# EAGLE design Motorsteuerung_v3 (EAGLE 9.6.2)
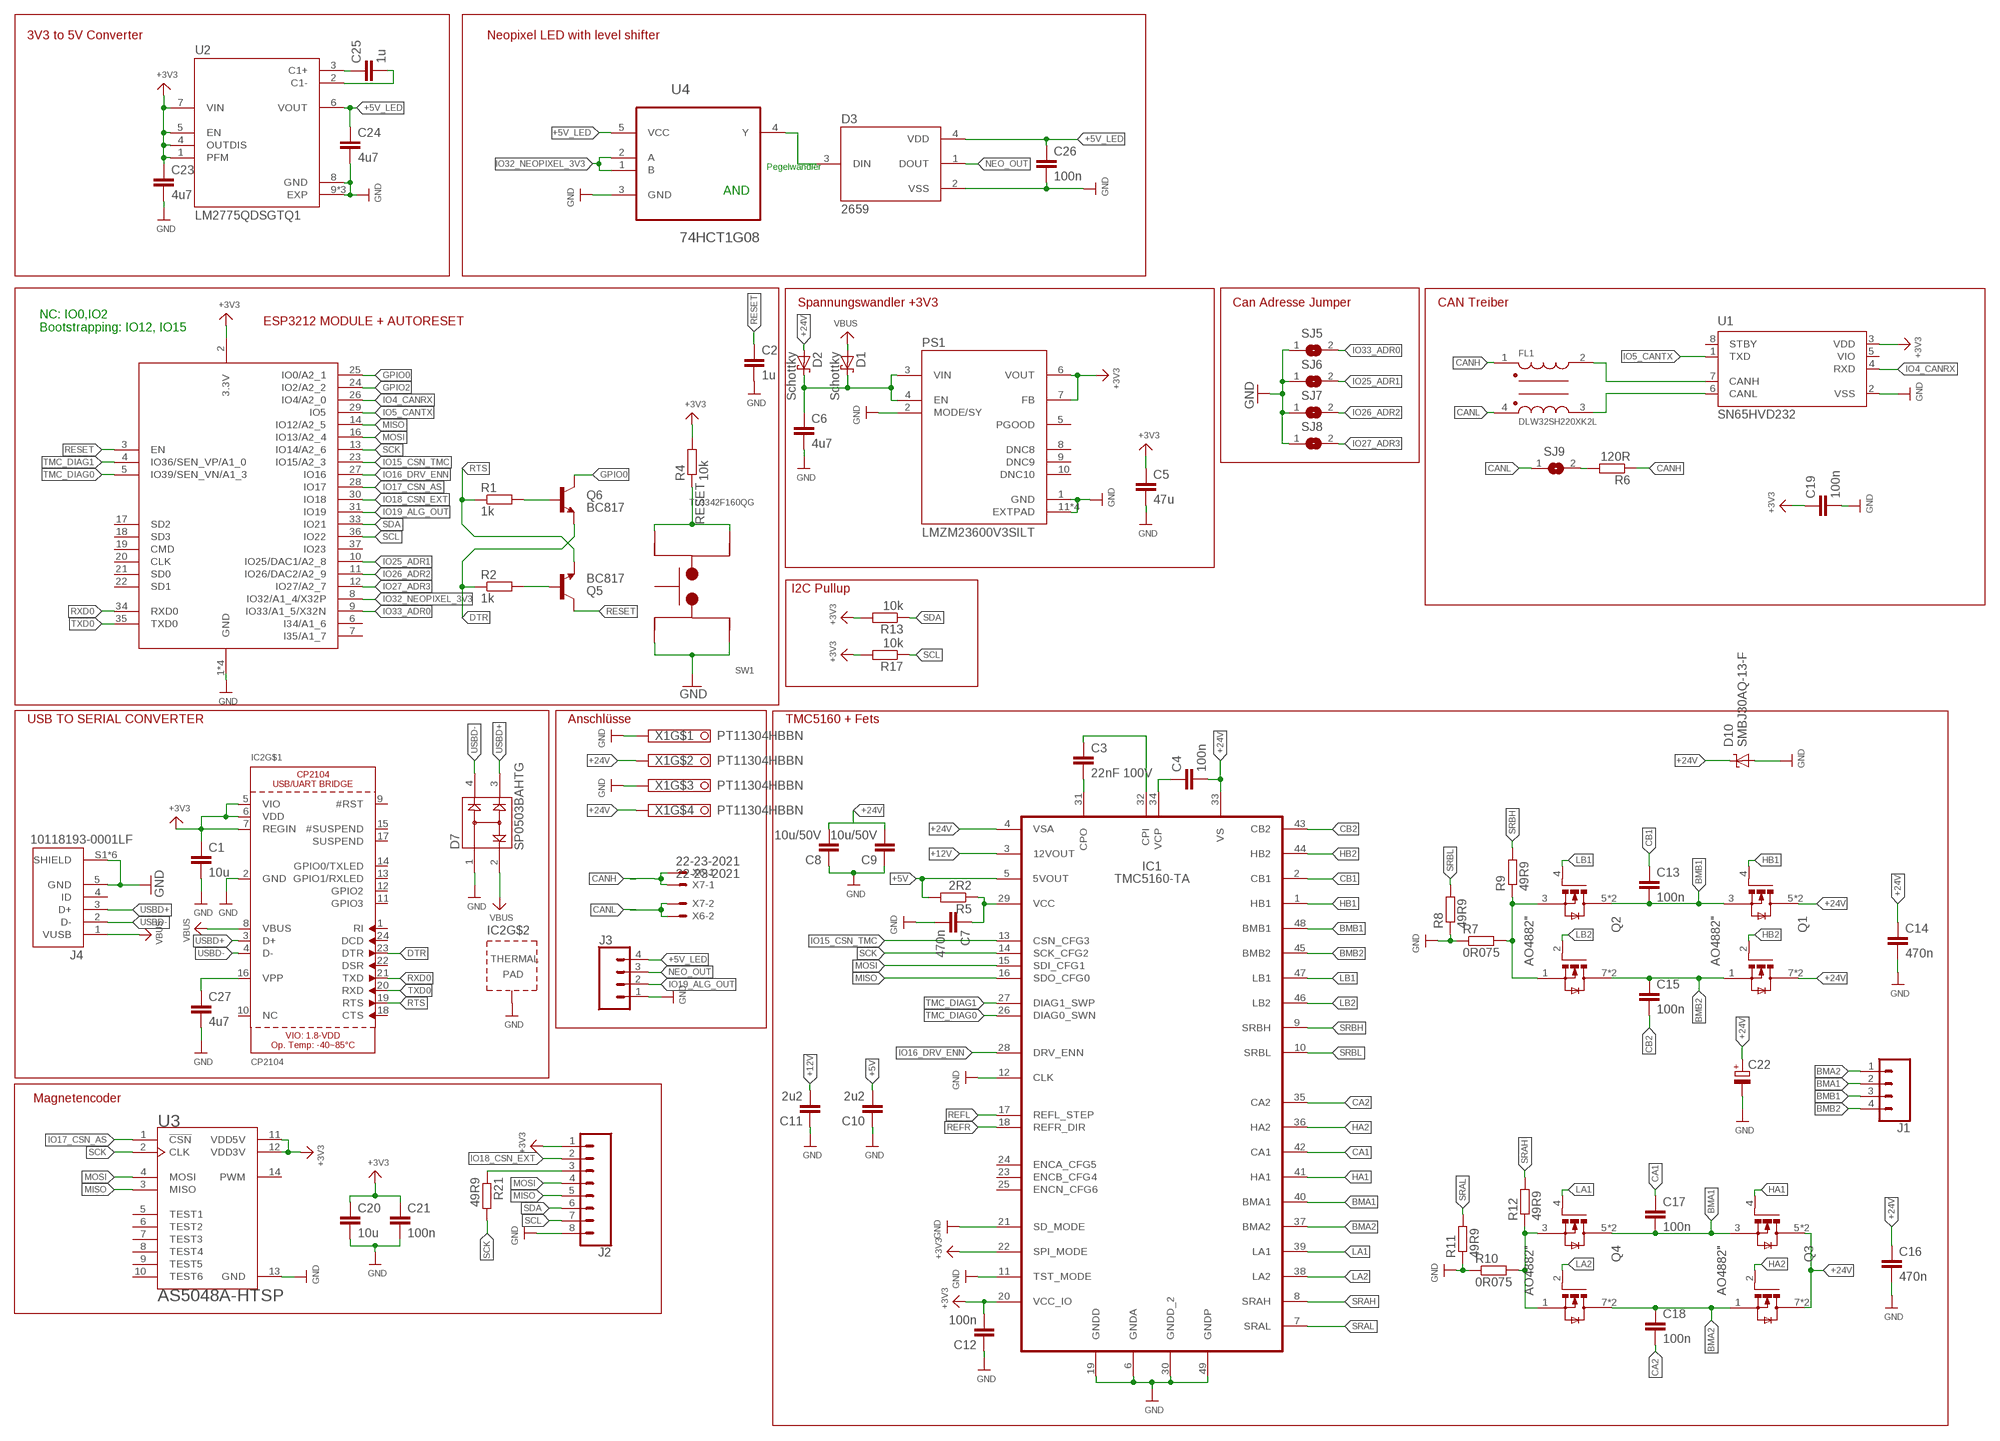
[diagram p0: schematic, sheet 1]

## Parts
C1  10u  C-EUC0805  [C0805]
C2  1u  C-EUC0805  [C0805]
C3  22nF 100V  C-EUC0805  [C0805]
C4  100n  C-EUC0805  [C0805]
C5  47u  C-EUC0805  [C0805]
C6  4u7  C-EUC0805  [C0805]
C7  470n  C-EUC0805  [C0805]
C8  10u/50V  C-EUC0805  [C0805]
C9  10u/50V  C-EUC0805  [C0805]
C10  2u2  C-EUC0805  [C0805]
C11  2u2  C-EUC0805  [C0805]
C12  100n  C-EUC0805  [C0805]
C13  100n  C-EUC0805  [C0805]
C14  470n  C-EUC0805  [C0805]
C15  100n  C-EUC0805  [C0805]
C16  470n  C-EUC0805  [C0805]
C17  100n  C-EUC0805  [C0805]
C18  100n  C-EUC0805  [C0805]
C19  100n  C-EUC0805  [C0805]
C20  10u  C-EUC0805  [C0805]
C21  100n  C-EUC0805  [C0805]
C22  CPOL-EUE5-10.5  [E5-10,5]
C23  4u7  C-EUC0805  [C0805]
C24  4u7  C-EUC0805  [C0805]
C25  1u  C-EUC0805  [C0805]
C26  100n  C-EUC0805  [C0805]
C27  4u7  C-EUC0805  [C0805]
D1  Schottky  SCHOTTKY-DIODESMD  [SMB]
D2  Schottky  SCHOTTKY-DIODESMD  [SMB]
D3  2659  [2659]
D7  SP0503BAHTG  [SOT143]
D10  SMBJ30AQ-13-F  SUPPRESSOR-SMBJ  [SMBJ]
FL1  DLW32SH220XK2L  DLW32SH110XK2L  [FIL_DLW32SH110XK2L]
IC1  TMC5160-TA  [TQFP48-EP]
IC2  CP2104  [QFN24_4MM_SMSC]
J1  CONN_04  [1X04]
J2  CONN_08BM08B-SRSS-TB  [BM08B-SRSS-TB]
J3  CONN_041.27MM  [1X04_1.27MM]
J4  10118193-0001LF  [FCI_10118193-0001LF]
PS1  LMZM23600V3SILT  [CONV_LMZM23600V3SILT]
Q1  AO4882"  [SOIC8]
Q2  AO4882"  [SOIC8]
Q3  AO4882"  [SOIC8]
Q4  AO4882"  [SOIC8]
Q5  BC817  TRANSISTOR_NPNSOT23-3  [SOT23-3]
Q6  BC817  TRANSISTOR_NPNSOT23-3  [SOT23-3]
R1  1k  R-EU_R0805  [R0805]
R2  1k  R-EU_R0805  [R0805]
R4  10k  R-EU_R0805  [R0805]
R5  2R2  R-EU_R0805  [R0805]
R6  120R  R-EU_R0805  [R0805]
R7  0R075  R-EU_R1206  [R1206]
R8  49R9  R-EU_R0805  [R0805]
R9  49R9  R-EU_R0805  [R0805]
R10  0R075  R-EU_R1206  [R1206]
R11  49R9  R-EU_R0805  [R0805]
R12  49R9  R-EU_R0805  [R0805]
R13  10k  R-EU_R0805  [R0805]
R17  10k  R-EU_R0805  [R0805]
R21  49R9  R-EU_R0805  [R0805]
SJ5  SJ  [SJ]
SJ6  SJ  [SJ]
SJ7  SJ  [SJ]
SJ8  SJ  [SJ]
SJ9  SJ  [SJ]
SW1  TL3342F160QG  [SW_TL3342F160QG]
U1  SN65HVD232  MCP2562-E/SN  [SOIC127P600X175-8N]
U2  LM2775QDSGTQ1  [SON50P200X200X80-9N]
U3  AS5048A-HTSP  [SOP65P640X120-14N]
U4  74HCT1G08  74LVC1G00GW  [SOT65P210X110-5N]
X1  PT11304HBBN  TYP184  [TYP184_FT]
X2  ESP32_WROOM32_SKINNY  [WROOM32_SKINNY]
X6  22-23-2021  [22-23-2021]
X7  22-23-2021  [22-23-2021]

## Nets
+3V3: C1.1 C5.1 C12.2 C19.1 C20.1 C21.1 C23.1 IC1.20(VCC_IO) IC1.22(SPI_MODE) IC2.5(VIO) IC2.6(VDD) IC2.7(REGIN) J2.1 PS1.6(VOUT) PS1.7(FB) R4.2 R13.2 R17.2 U1.3(VDD) U2.1(PFM) U2.4(OUTDIS) U2.5(EN) U2.7(VIN) U3.11(VDD5V) U3.12(VDD3V) X2.2(3.3V)
+5V: C10.2 IC1.5(5VOUT) R5.2
+5V_LED: C24.1 C26.1 D3.4(VDD) J3.4 U2.6(VOUT) U4.5(VCC)
+12V: C11.2 IC1.3(12VOUT)
+24V: C4.2 C8.2 C9.2 C14.1 C16.1 C22.+ D2.A D10.C IC1.4(VSA) IC1.33(VS) Q1.5(D1) Q1.6(D1) Q1.7(D2) Q1.8(D2) Q3.5(D1) Q3.6(D1) Q3.7(D2) Q3.8(D2) X1.2 X1.4
BMA1: C17.2 IC1.40(BMA1) J1.2 Q3.3(S1) Q4.5(D1) Q4.6(D1)
BMA2: C18.1 IC1.37(BMA2) J1.1 Q3.1(S2) Q4.7(D2) Q4.8(D2)
BMB1: C13.2 IC1.48(BMB1) J1.3 Q1.3(S1) Q2.5(D1) Q2.6(D1)
BMB2: C15.1 IC1.45(BMB2) J1.4 Q1.1(S2) Q2.7(D2) Q2.8(D2)
CA1: C17.1 IC1.42(CA1)
CA2: C18.2 IC1.35(CA2)
CANH: FL1.1 R6.1 X6.1 X7.1
CANL: FL1.4 SJ9.1 X6.2 X7.2
CB1: C13.1 IC1.2(CB1)
CB2: C15.2 IC1.43(CB2)
DTR: IC2.23(DTR) Q6.2(E) R2.1
GND: C1.2 C2.2 C5.2 C6.2 C7.2 C8.1 C9.1 C10.1 C11.1 C12.1 C14.2 C16.2 C19.2 C20.2 C21.2 C22.- C23.2 C24.2 C26.2 C27.2 D3.2(VSS) D7.1 D10.A IC1.6(GNDA) IC1.11(TST_MODE) IC1.12(CLK) IC1.19(GNDD) IC1.21(SD_MODE) IC1.30(GNDD_2) IC1.49(GNDP) IC2.2(GND) IC2.THERM(TP) J2.8 J3.1 J4.5(GND) J4.S1(SHIELD) J4.S2(SHIELD) J4.S3(SHIELD) J4.S4(SHIELD) J4.S5(SHIELD) J4.S6(SHIELD) PS1.1(GND) PS1.2(MODE/SY) PS1.11(EXTPAD) PS1.11_1(EXTPAD) PS1.11_2(EXTPAD) PS1.11_3(EXTPAD) R7.1 R8.1 R10.1 R11.1 SJ5.1 SJ6.1 SJ7.1 SJ8.1 SW1.3 SW1.4 U1.2(VSS) U2.8(GND) U2.9(EXP) U2.9_1(EXP) U2.9_2(EXP) U3.13(GND) U4.3(GND) X1.1 X1.3 X2.1(GND) X2.15(GND) X2.38(GND) X2.P$1(GND)
GPIO0: Q6.3(C) X2.25(IO0/A2_1)
GPIO2: X2.24(IO2/A2_2)
HA1: IC1.41(HA1) Q3.4(G1)
HA2: IC1.36(HA2) Q3.2(G2)
HB1: IC1.1(HB1) Q1.4(G1)
HB2: IC1.44(HB2) Q1.2(G2)
IO4_CANRX: U1.4(RXD) X2.26(IO4/A2_0)
IO5_CANTX: U1.1(TXD) X2.29(IO5)
IO15_CSN_TMC: IC1.13(CSN_CFG3) X2.23(IO15/A2_3)
IO16_DRV_ENN: IC1.28(DRV_ENN) X2.27(IO16)
IO17_CSN_AS: U3.1(!CSN) X2.28(IO17)
IO18_CSN_EXT: J2.2 X2.30(IO18)
IO19_ALG_OUT: J3.2 X2.31(IO19)
IO25_ADR1: SJ6.2 X2.10(IO25/DAC1/A2_8)
IO26_ADR2: SJ7.2 X2.11(IO26/DAC2/A2_9)
IO27_ADR3: SJ8.2 X2.12(IO27/A2_7)
IO32_NEOPIXEL_3V3: U4.1(B) U4.2(A) X2.8(IO32/A1_4/X32P)
IO33_ADR0: SJ5.2 X2.9(IO33/A1_5/X32N)
LA1: IC1.39(LA1) Q4.4(G1)
LA2: IC1.38(LA2) Q4.2(G2)
LB1: IC1.47(LB1) Q2.4(G1)
LB2: IC1.46(LB2) Q2.2(G2)
MISO: IC1.16(SDO_CFG0) J2.5 U3.3(MISO) X2.14(IO12/A2_5)
MOSI: IC1.15(SDI_CFG1) J2.4 U3.4(MOSI) X2.16(IO13/A2_4)
N$1: C25.1 U2.3(C1+)
N$2: C6.1 D1.C D2.C PS1.3(VIN) PS1.4(EN)
N$3: C3.2 IC1.31(CPO)
N$4: C3.1 IC1.32(CPI)
N$5: C4.1 IC1.34(VCP)
N$6: C25.2 U2.2(C1-)
N$7: C7.1 IC1.29(VCC) R5.1
N$8: FL1.2 U1.7(CANH)
N$9: Q4.1(S2) Q4.3(S1) R10.2 R12.1
N$10: Q2.1(S2) Q2.3(S1) R7.2 R9.1
N$11: FL1.3 U1.6(CANL)
N$12: Q5.1(B) R2.2
N$13: Q6.1(B) R1.2
N$15: D3.3(DIN) U4.4(Y)
N$16: R6.2 SJ9.2
N$21: J2.3 R21.1
N$22: C27.1 IC2.16(VPP)
NEO_OUT: D3.1(DOUT) J3.3
REFL: IC1.17(REFL_STEP)
REFR: IC1.18(REFR_DIR)
RESET: C2.1 Q5.3(C) R4.1 SW1.1 SW1.2 X2.3(EN)
RTS: IC2.19(RTS) Q5.2(E) R1.1
RXD0: IC2.21(TXD) X2.34(RXD0)
SCK: IC1.14(SCK_CFG2) R21.2 U3.2(CLK) X2.13(IO14/A2_6)
SCL: J2.7 R17.1 X2.36(IO22)
SDA: J2.6 R13.1 X2.33(IO21)
SRAH: IC1.8(SRAH) R12.2
SRAL: IC1.7(SRAL) R11.2
SRBH: IC1.9(SRBH) R9.2
SRBL: IC1.10(SRBL) R8.2
TMC_DIAG0: IC1.26(DIAG0_SWN) X2.5(IO39/SEN_VN/A1_3)
TMC_DIAG1: IC1.27(DIAG1_SWP) X2.4(IO36/SEN_VP/A1_0)
TXD0: IC2.20(RXD) X2.35(TXD0)
USBD+: D7.3 IC2.3(D+) J4.3(D+)
USBD-: D7.4 IC2.4(D-) J4.2(D-)
VBUS: D1.A D7.2 IC2.8(VBUS) J4.1(VUSB)
Unconnected: IC1.23(ENCB_CFG4) IC1.24(ENCA_CFG5) IC1.25(ENCN_CFG6) IC2.1(RI) IC2.9(#RST) IC2.10(NC) IC2.11(GPIO3) IC2.12(GPIO2) IC2.13(GPIO1/RXLED) IC2.14(GPIO0/TXLED) IC2.15(#SUSPEND) IC2.17(SUSPEND) IC2.18(CTS) IC2.22(DSR) IC2.24(DCD) J4.4(ID) PS1.5(PGOOD) PS1.8(DNC8) PS1.9(DNC9) PS1.10(DNC10) U1.8(STBY) U3.5(TEST1) U3.6(TEST2) U3.7(TEST3) U3.8(TEST4) U3.9(TEST5) U3.10(TEST6) U3.14(PWM) X2.6(I34/A1_6) X2.7(I35/A1_7) X2.17(SD2) X2.18(SD3) X2.19(CMD) X2.20(CLK) X2.21(SD0) X2.22(SD1) X2.37(IO23)

## Notes on the sheet
- 3V3 to 5V Converter | Neopixel LED with level shifter
- Pegelwandler
- AND
- Spannungswandler +3V3 | Can Adresse Jumper | CAN Treiber
- ESP3212 MODULE + AUTORESET
- NC: IO0,IO2
  Bootstrapping: IO12, IO15
- I2C Pullup
- USB TO SERIAL CONVERTER | Anschlüsse | TMC5160 + Fets
- Magnetencoder

## Power pins joined to a net without a drawn wire
VIO: U1.5(VIO)

## Library data of the parts
C1-C21 C23-C27 = rcl:C-EU: CAPACITOR, European symbol; SPICEPREFIX: C
C22 = resistor:CPOL-EU: POLARIZED CAPACITOR, European symbol
D1 D2 = diode:SCHOTTKY-DIODE: Schottky Diode
D3 = 2659:2659: NeoPixel Mini 3535 RGB LEDs w/ Integrated Driver Chip - White; AVAILABILITY: Unavailable; DESCRIPTION: Addressable Lighting Neopixel 10 LED Discrete Serial _Shift Register_ Red, Green, Blue _RGB_ 3.50mm L x 3.50mm W; MF: Adafruit Industries; MP: 2659; PACKAGE: TQFP-32 Adafruit Industries; PRICE: None
D7 = SP0503BAHTG:SP0503BAHTG: TVS DIODE 5.5VWM 8.5VC SOT143; AVAILABILITY: Unavailable; DESCRIPTION: SP050xBA Series 8 V 30 pF Uni-Directional SMT TVS Avalanche Diode Array SOT-143; MF: Littelfuse Inc.; MP: SP0503BAHTG; PACKAGE: SOT-143 Littelfuse; PRICE: None
D10 = diode:SUPPRESSOR-: Suppressor diode
FL1 = DLW32SH110XK2L:DLW32SH110XK2L: 100UH-30%/+50% (AT 0.1MHZ) 150MA; AVAILABILITY: Unavailable; DESCRIPTION: 11µH @ 100kHz 2 Line Common Mode Choke Surface Mount 300mA DCR 400mOhm; MF: Murata; MP: DLW32SH110XK2L; PACKAGE: Horizontal-4 Murata; PRICE: None
IC1 = TMC5160-TA:TMC5160-TA: Universal high voltage controller for two-phase bipolar stepper motor. TQFP48-EP; AVAILABILITY: Unavailable; DESCRIPTION: Motor Driver, Stepper, Tqfp-48; MF: Trinamic Motion; MP: TMC5160-TA; PACKAGE: TQFP-48 Trinamic Motion; PRICE: None
IC2 = microbuilder:CP2104: CP2104 - USB to UART Bridge VDD Output: 3.45V
J1 = SparkFun-Connectors:CONN_04: Multi connection point. Often used as Generic Header-pin footprint for 0.1 inch spaced/style header connections On any of the 0.1 inch spaced packages, you can populate with these: Break Away Headers - Straight <https://www.sparkfun.com/products/116> (PRT-00116) Break Away Male Headers - Right Angle <https://www.sparkfun.com/products/553> (PRT-00553) Female Headers <https://www.sparkfun.com/products/115> (PRT-00115) Break Away Headers - Machine Pin <https://www.sparkfun.com/products/117> (PRT-00117) Break Away Female Headers - Swiss Machine Pin <https://www.sparkfun.com/products/743> (PRT-00743) For SCREWTERMINALS and SPRING TERMINALS visit here: Screw Terimnals on SparkFun.com <https://www.sparkfun.com/search/results?term=Screw+Terminals> (5mm/3.5mm/2.54mm spacing) This device is also useful as a general connection point to wire up your design to another part of your project. Our various solder wires solder well into these plated through hole pads. Hook-Up Wire - Assortment (Stranded, 22 AWG) <https://www.sparkfun.com/products/11375> (PRT-11375) Hook-Up Wire - Assortment (Solid Core, 22 AWG) <https://www.sparkfun.com/products/11367> (PRT-11367) View the entire wire category on our website here <https://www.sparkfun.com/categories/141> Special notes: Molex polarized connector foot print use with SKU : PRT-08231 with associated crimp pins and housings. 1MM SMD Version SKU: PRT-10208; PROD_ID: CONN-09696
J2 = SparkFun-Connectors:CONN_08: Multi connection point. Often used as Generic Header-pin footprint for 0.1 inch spaced/style header connections On any of the 0.1 inch spaced packages, you can populate with these: Break Away Headers - Straight <https://www.sparkfun.com/products/116> (PRT-00116) Break Away Male Headers - Right Angle <https://www.sparkfun.com/products/553> (PRT-00553) Female Headers <https://www.sparkfun.com/products/115> (PRT-00115) Break Away Headers - Machine Pin <https://www.sparkfun.com/products/117> (PRT-00117) Break Away Female Headers - Swiss Machine Pin <https://www.sparkfun.com/products/743> (PRT-00743) Arduino Stackable Header - 8 Pin <https://www.sparkfun.com/products/9279> (PRT-09279) For SCREWTERMINALS and SPRING TERMINALS visit here: Screw Terimnals on SparkFun.com <https://www.sparkfun.com/search/results?term=Screw+Terminals> (5mm/3.5mm/2.54mm spacing) This device is also useful as a general connection point to wire up your design to another part of your project. Our various solder wires solder well into these plated through hole pads. Hook-Up Wire - Assortment (Stranded, 22 AWG) <https://www.sparkfun.com/products/11375> (PRT-11375) Hook-Up Wire - Assortment (Solid Core, 22 AWG) <https://www.sparkfun.com/products/11367> (PRT-11367) View the entire wire category on our website here <https://www.sparkfun.com/categories/141> Special notes: Molex polarized connector foot print use with SKU : PRT-08231 with associated crimp pins and housings. 1MM SMD Version SKU: PRT-10208 NOTES ON THE VARIANTS LOCK and LOCK_LONGPADS... This footprint was designed to help hold the alignment of a through-hole component (i.e. 6-pin header) while soldering it into place. You may notice that each hole has been shifted either up or down by 0.005 of an inch from it's more standard position (which is a perfectly straight line). This slight alteration caused the pins (the squares in the middle) to touch the edges of the holes. Because they are alternating, it causes a "brace" to hold the component in place. 0.005 has proven to be the perfect amount of "off-center" position when using our standard breakaway headers. Although looks a little odd when you look at the bare footprint, once you have a header in there, the alteration is very hard to notice. Also,if you push a header all the way into place, it is covered up entirely on the bottom side.; PROD_ID: CONN-10556
J3 = SparkFun-Connectors:CONN_04: Multi connection point. Often used as Generic Header-pin footprint for 0.1 inch spaced/style header connections On any of the 0.1 inch spaced packages, you can populate with these: Break Away Headers - Straight <https://www.sparkfun.com/products/116> (PRT-00116) Break Away Male Headers - Right Angle <https://www.sparkfun.com/products/553> (PRT-00553) Female Headers <https://www.sparkfun.com/products/115> (PRT-00115) Break Away Headers - Machine Pin <https://www.sparkfun.com/products/117> (PRT-00117) Break Away Female Headers - Swiss Machine Pin <https://www.sparkfun.com/products/743> (PRT-00743) For SCREWTERMINALS and SPRING TERMINALS visit here: Screw Terimnals on SparkFun.com <https://www.sparkfun.com/search/results?term=Screw+Terminals> (5mm/3.5mm/2.54mm spacing) This device is also useful as a general connection point to wire up your design to another part of your project. Our various solder wires solder well into these plated through hole pads. Hook-Up Wire - Assortment (Stranded, 22 AWG) <https://www.sparkfun.com/products/11375> (PRT-11375) Hook-Up Wire - Assortment (Solid Core, 22 AWG) <https://www.sparkfun.com/products/11367> (PRT-11367) View the entire wire category on our website here <https://www.sparkfun.com/categories/141> Special notes: Molex polarized connector foot print use with SKU : PRT-08231 with associated crimp pins and housings. 1MM SMD Version SKU: PRT-10208
J4 = 10118193-0001LF:10118193-0001LF: Micro USB B Type Receptacle; AVAILABILITY: Unavailable; DESCRIPTION: USB - micro B USB 2.0 Receptacle Connector 5 Position Surface Mount, Right Angle; Through Hole; DIGIKEY-PURCHASE-URL: https://snapeda.com/shop?store=DigiKey&id=4800618; MF: Amphenol ICC (FCI); MOUSER-PURCHASE-URL: https://snapeda.com/shop?store=Mouser&id=4800618; MP: 10118193-0001LF; PACKAGE: None; PRICE: None
PS1 = LMZM23600V3SILT:LMZM23600V3SILT: 36-V, 0.5-A Step-Down DC/DC Power Module in 3.8-mm × 3-mm Package 10-uSiP -40 to 125; AVAILABILITY: Unavailable; DESCRIPTION: 36-V, 0.5-A Step-Down DC/DC Power Module in 3.8-mm × 3-mm Package 10-uSiP -40 to 125; MF: Texas Instruments; MP: LMZM23600V3SILT; PACKAGE: Module Texas Instruments; PRICE: None
Q1-Q4 = AO4882:AO4882: Dual N-Channel Power Trench® MOSFET 40 V, 12 A, 10 mΩ
Q5 Q6 = SparkFun:TRANSISTOR_NPN: Transistor NPN BJT configuration in SOT23 package. MMBT2222 is the common NPN we use. Double check BCE configuration again layout.
R1 R2 R4-R13 R17 R21 = rcl:R-EU_: RESISTOR, European symbol; SPICEPREFIX: R
SJ5-SJ9 = jumper:SJ: SMD solder JUMPER
SW1 = TL3342F160QG:TL3342F160QG: TL3342 Series SPST 1.6 N Round Button Gull Wing Surface Mount Tactile Switch; AVAILABILITY: Unavailable; DESCRIPTION: TL3342 Series SPST 1.6 N Round Button Gull Wing Surface Mount Tactile Switch; MF: E-Switch; MP: TL3342F160QG; PACKAGE: None; PRICE: None
U1 = MCP2562-E_SN:MCP2562-E/SN: MCP2562 Series 5 V Surface Mount High-Speed CAN Transceiver - SOIC-8; AVAILABILITY: Unavailable; DESCRIPTION: Microchip MCP2562-E/SN, CAN Transceiver 1MBps 1-channel IEC 61000-4-2, 8-Pin SOIC; MF: Microchip; MP: MCP2562-E/SN; PACKAGE: SO-8 Microchip; PRICE: None
U2 = LM2775QDSGTQ1:LM2775QDSGTQ1: IC REG CHARG PUMP 5V 200MA 8WSON; AVAILABILITY: Unavailable; DESCRIPTION: Charge Pump Switching Regulator IC Positive Fixed 5V 1 Output 200mA 8-WDFN Exposed Pad; MF: Texas Instruments; MP: LM2775QDSGTQ1; PACKAGE: WDFN-8 Texas Instruments; PRICE: None
U3 = AS5048A-HTSP:AS5048A-HTSP: AS5048B Series 360° 3.3 / 5 V 14 bit Magnetic Rotary Encoder - TSSOP-14; AVAILABILITY: Unavailable; DESCRIPTION: Ic Encoder Rotary 14-Tssop; MF: ams; MP: AS5048A-HTSP; PACKAGE: TSSOP-14 ams; PRICE: None
U4 = 74LVC1G00GW:74LVC1G00GW: Single 2-input NAND gate; AVAILABILITY: Unavailable; DESCRIPTION: NAND Gate 1-Element 2-IN CMOS 5-Pin TSSOP T/R; MF: Nexperia; MP: 74LVC1G00GW; PACKAGE: None; PRICE: None
X1 = MetzConnect182_183:TYP184
X2 = microbuilder:ESP32_WROOM32
X6 X7 = con-molex:22-23-2021: .100" (2.54mm) Center Header - 2 Pin; MF: MOLEX; MPN: 22-23-2021; OC_FARNELL: 1462926; OC_NEWARK: 25C3832

## Net classes
1 power: width 0.254 mm

## Board
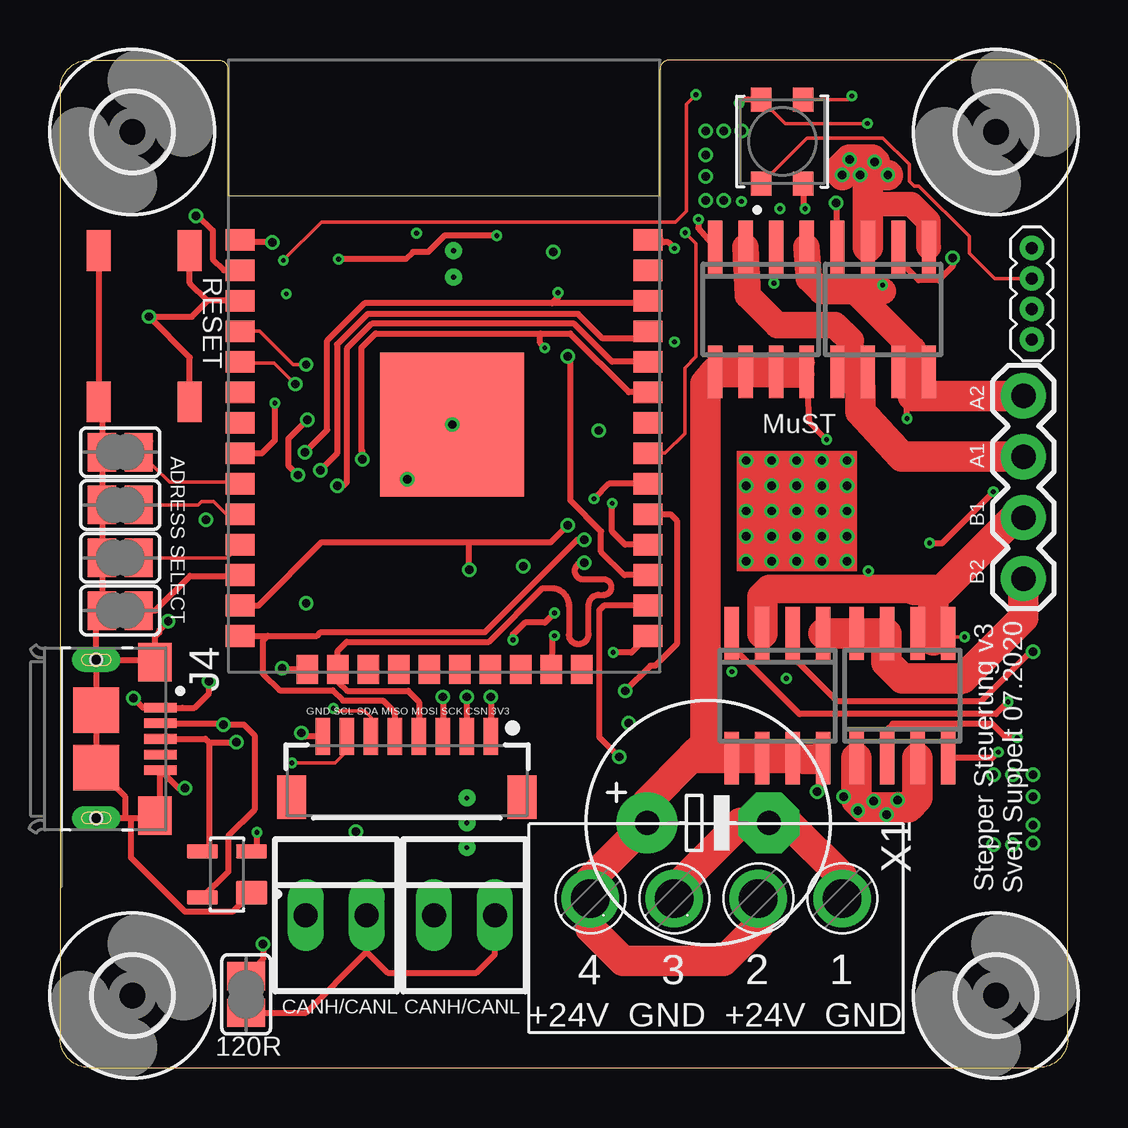
[diagram p1: board, top side]
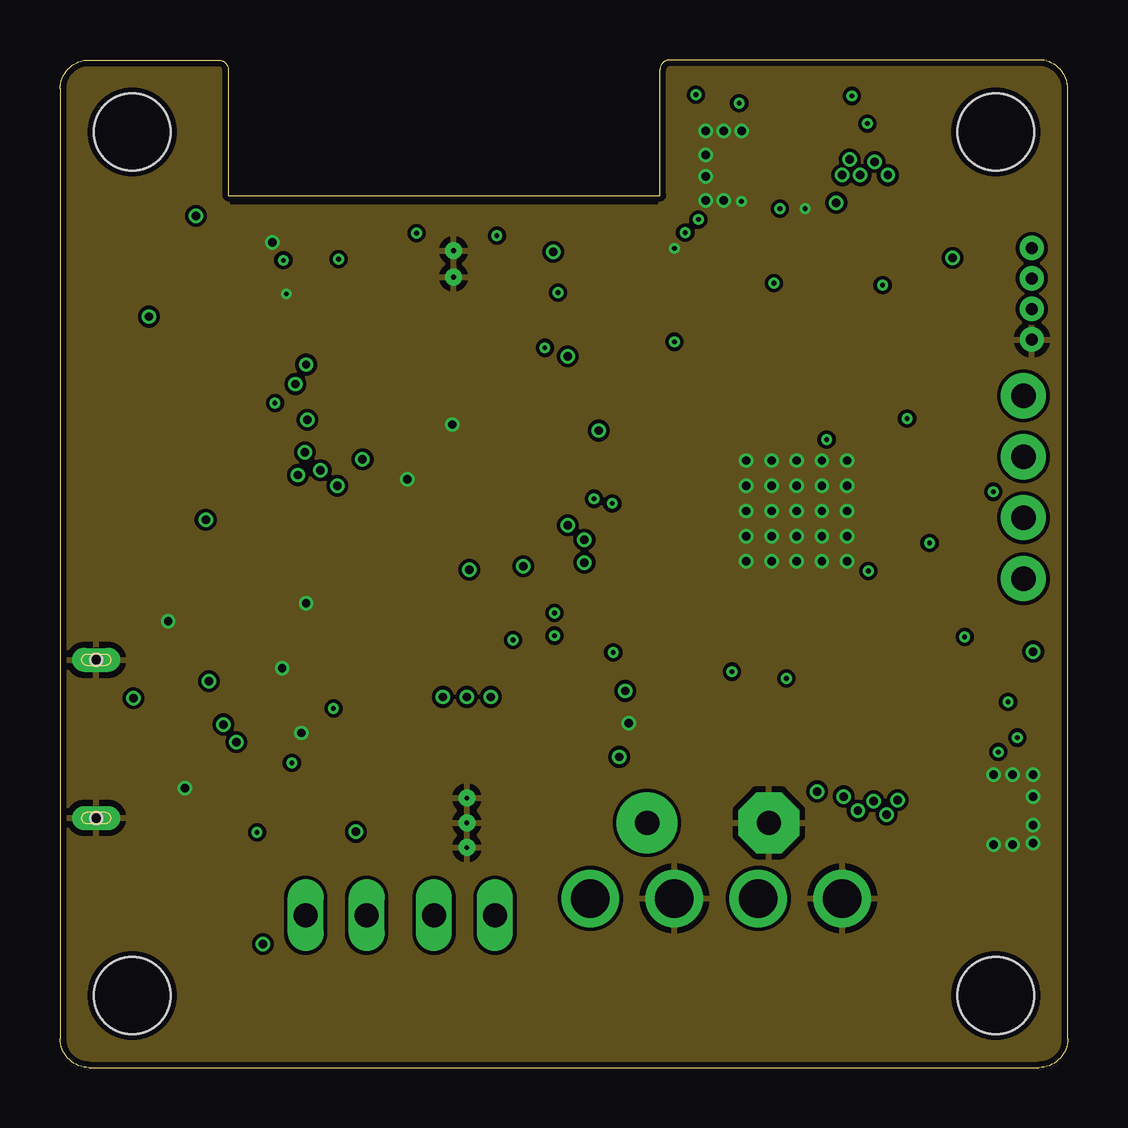
[diagram p2: board, inner layer Route2]
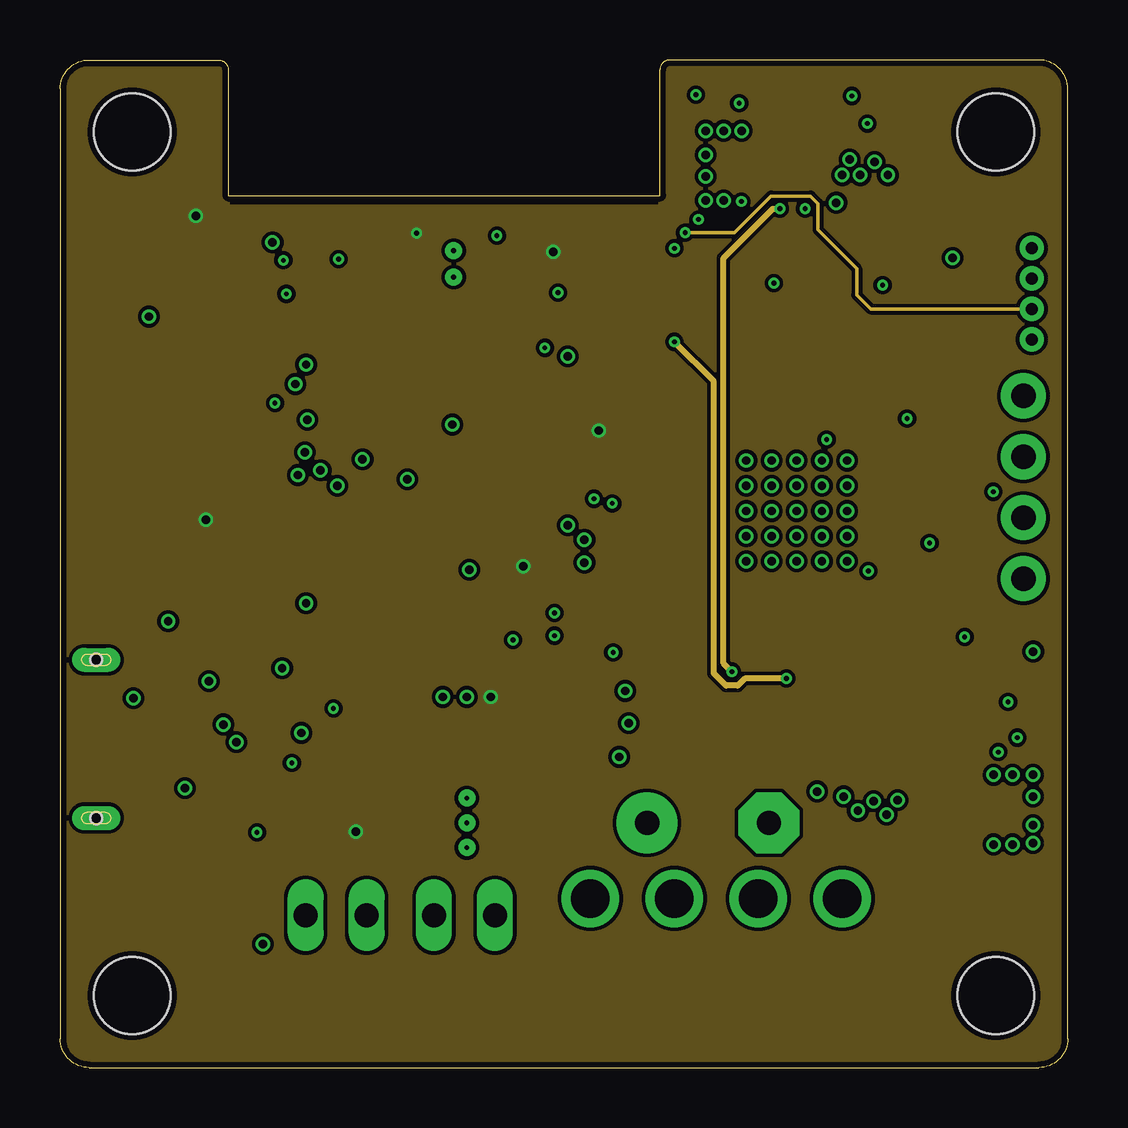
[diagram p3: board, inner layer Route15]
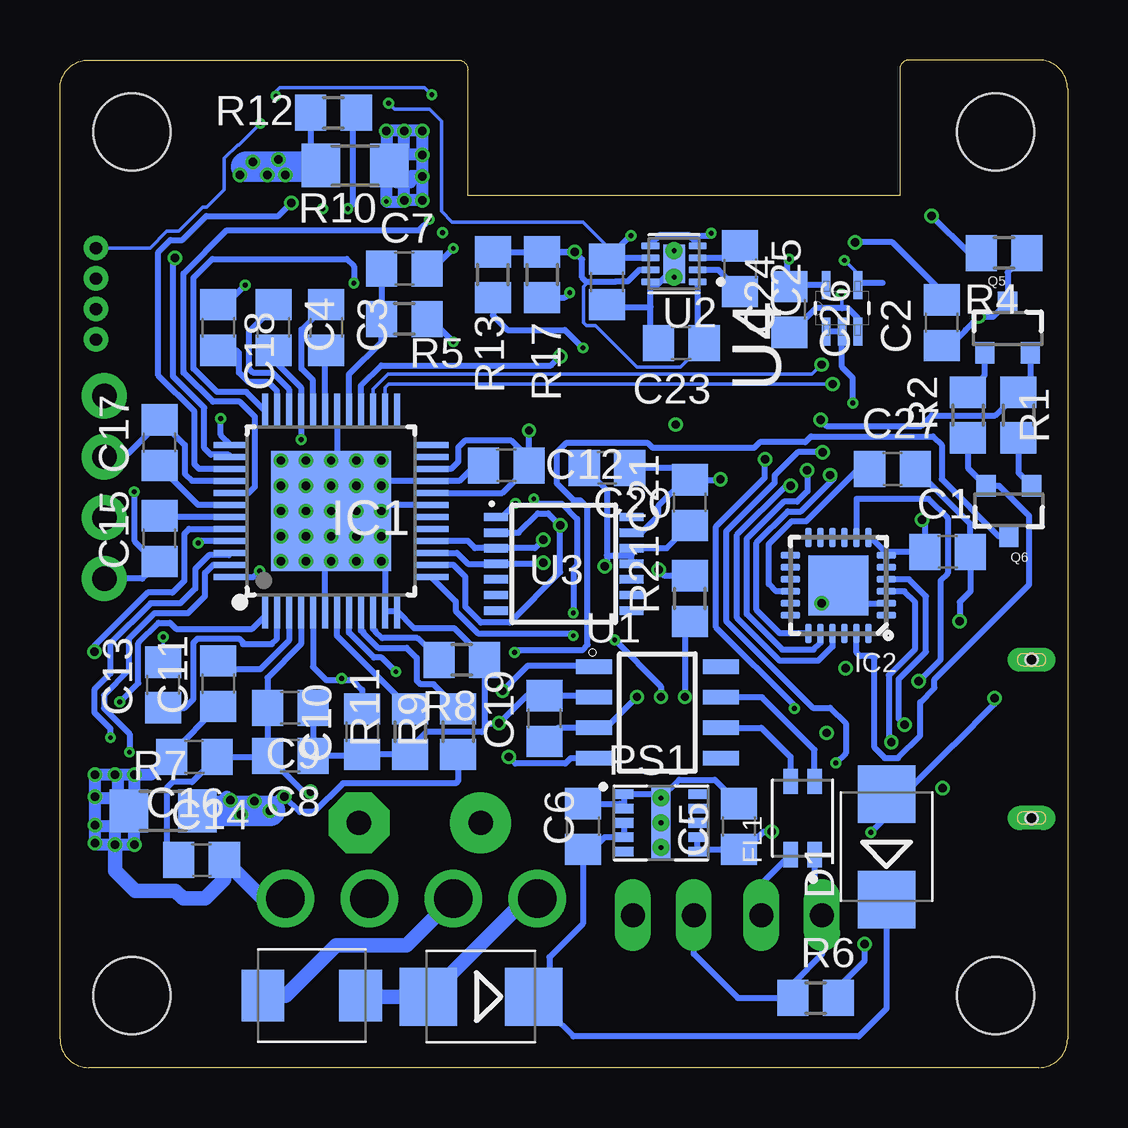
[diagram p4: board, bottom side, seen from below]

Size 42 x 42 mm. Coordinates in mm from the lower left corner, seen from the top.
Outline: 1.2,0 40.8,0 arc90 42,1.2 42,40.8 arc90 40.8,42 25.4,42 arc90 25,41.6 25,36.35 7,36.35 7,41.6 arc90 6.6,42 1.2,42 arc90 0,40.8 0,1.2 arc90 1.2,0
Copper layers (1+2*15+16): Top 0.035mm / dielectric 0.2mm / Route2 0.0175mm / dielectric 1.065mm / Route15 0.0175mm / dielectric 0.2mm / Bottom 0.035mm
Design rules "DesignRule4Layer": minimum track width 6mil, minimum drill 0.2mm, track to track 6mil, track to pad 6mil, pad to pad 6mil, via to via 6mil, smd to smd 6mil, copper to edge 10mil, drill to drill 6mil, minimum pad ring 10mil, minimum via ring 0.125mm, stop-mask expansion 4mil, vias tented up to drill 0.4mm, thermal gap 10mil

### Footprints (pad centres in the part's own frame; a part is rotated, then mirrored left to right if it is on the bottom)
C0805 = smd 1.3 x 1.5: 1 -0.95,0; 2 0.95,0
E5-10,5 = drill 1.016 pad 2.54: + -2.54,0 | drill 1.016 pad 2.54 octagon: - 2.54,0
SMB = smd 2.4 x 2.4: A 2.2,0; C -2.2,0
2659 = smd 1 x 0.85: 1 -1.75,0.875; 2 -1.75,-0.875; 3 1.75,-0.875; 4 1.75,0.875
SOT143 = smd 0.99 x 1.3: 1 -0.76,-1.025 | smd 0.59 x 1.3: 2 0.96,-1.025; 3 0.96,1.025; 4 -0.96,1.025
SMBJ = smd 1.78 x 2.16: A 2.04,0; C -2.03,0
FIL_DLW32SH110XK2L = smd 1.05 x 0.6: 1 -1.525,-0.5; 2 1.525,-0.5; 3 1.525,0.5; 4 -1.525,0.5
TQFP48-EP = smd 0.25 x 1.45: 1 -2.75,-4.175; 2 -2.25,-4.175; 3 -1.75,-4.175; 4 -1.25,-4.175; 5 -0.75,-4.175; 6 -0.25,-4.175; 7 0.25,-4.175; 8 0.75,-4.175; 9 1.25,-4.175; 10 1.75,-4.175; 11 2.25,-4.175; 12 2.75,-4.175; 25 2.75,4.175; 26 2.25,4.175; 27 1.75,4.175; 28 1.25,4.175; 29 0.75,4.175; 30 0.25,4.175; 31 -0.25,4.175; 32 -0.75,4.175; 33 -1.25,4.175; 34 -1.75,4.175; 35 -2.25,4.175; 36 -2.75,4.175 | smd 1.45 x 0.25: 13 4.175,-2.75; 14 4.175,-2.25; 15 4.175,-1.75; 16 4.175,-1.25; 17 4.175,-0.75; 18 4.175,-0.25; 19 4.175,0.25; 20 4.175,0.75; 21 4.175,1.25; 22 4.175,1.75; 23 4.175,2.25; 24 4.175,2.75; 37 -4.175,2.75; 38 -4.175,2.25; 39 -4.175,1.75; 40 -4.175,1.25; 41 -4.175,0.75; 42 -4.175,0.25; 43 -4.175,-0.25; 44 -4.175,-0.75; 45 -4.175,-1.25; 46 -4.175,-1.75; 47 -4.175,-2.25; 48 -4.175,-2.75 | smd 5 x 5: 49 0,0
QFN24_4MM_SMSC = smd 0.8 x 0.28: 1 -2,1.25; 2 -2,0.75; 3 -2,0.25; 4 -2,-0.25; 5 -2,-0.75; 6 -2,-1.25; 13 2,-1.25; 14 2,-0.75; 15 2,-0.25; 16 2,0.25; 17 2,0.75; 18 2,1.25 | smd 0.28 x 0.8: 7 -1.25,-2; 8 -0.75,-2; 9 -0.25,-2; 10 0.25,-2; 11 0.75,-2; 12 1.25,-2; 19 1.25,2; 20 0.75,2; 21 0.25,2; 22 -0.25,2; 23 -0.75,2; 24 -1.25,2 | smd 2.5 x 2.5: THERM 0,0
1X04 = drill 1.016 pad 1.88: 1 0,0; 2 2.54,0; 3 5.08,0; 4 7.62,0
BM08B-SRSS-TB = smd 0.6 x 1.55: 1 -3.5,0; 2 -2.5,0; 3 -1.5,0; 4 -0.5,0; 5 0.5,0; 6 1.5,0; 7 2.5,0; 8 3.5,0 | smd 1.2 x 1.8: P$9 4.8,2.525; P$10 -4.8,2.525
1X04_1.27MM = drill 0.508 pad 1: 1 0,0; 2 1.27,0; 3 2.54,0; 4 3.81,0
FCI_10118193-0001LF = smd 0.4 x 1.35: 1 -1.3,2.675; 2 -0.65,2.675; 3 0,2.675; 4 0.65,2.675; 5 1.3,2.675 | smd 1.6 x 1.4: S1 -3.2,2.45; S2 3.2,2.45 | smd 1.9 x 1.9: S3 1.2,0; S4 -1.2,0 | drill 0.5 pad 0.9 long: S5 -3.3,0; S6 3.3,0 | hole 0.5: -3.3,0; 3.3,0
CONV_LMZM23600V3SILT = smd 0.75 x 0.4: 1 -1.525,1.2; 2 -1.525,0.6; 3 -1.525,0; 4 -1.525,-0.6; 5 -1.525,-1.2; 6 1.525,-1.2; 7 1.525,-0.6; 8 1.525,0; 9 1.525,0.6; 10 1.525,1.2 | smd 0.8 x 3: 11 0,0 | drill 0.2 pad 0.3: 11_1 0,1.03; 11_2 0,0; 11_3 0,-1.03
SOIC8 = smd 0.6 x 2.2: 1 -1.905,-2.6; 2 -0.635,-2.6; 3 0.635,-2.6; 4 1.905,-2.6; 5 1.905,2.6; 6 0.635,2.6; 7 -0.635,2.6; 8 -1.905,2.6
SOT23-3 = smd 0.8 x 0.9: 1 -0.95,-1; 2 0.95,-1; 3 0,1.1
R0805 = smd 1.3 x 1.5: 1 -0.95,0; 2 0.95,0
R1206 = smd 1.6 x 1.803: 1 -1.422,0; 2 1.422,0
SJ = smd 1.168 x 1.6: 1 -0.762,0; 2 0.762,0
SW_TL3342F160QG = smd 1.7 x 1: 1 -3.15,-1.9; 2 3.15,-1.9; 3 -3.15,1.9; 4 3.15,1.9
SOIC127P600X175-8N = smd 1.5 x 0.6: 1 -2.65,1.905; 2 -2.65,0.635; 3 -2.65,-0.635; 4 -2.65,-1.905; 5 2.65,-1.905; 6 2.65,-0.635; 7 2.65,0.635; 8 2.65,1.905
SON50P200X200X80-9N = smd 0.76 x 0.28: 1 -0.985,0.75; 2 -0.985,0.25; 3 -0.985,-0.25; 4 -0.985,-0.75; 5 0.985,-0.75; 6 0.985,-0.25; 7 0.985,0.25; 8 0.985,0.75 | smd 0.9 x 1.6: 9 0,0 | drill 0.2 pad 0.3: 9_1 0,0.55; 9_2 0,-0.55
SOP65P640X120-14N = smd 1 x 0.35: 1 -2.825,1.95; 2 -2.825,1.3; 3 -2.825,0.65; 4 -2.825,0; 5 -2.825,-0.65; 6 -2.825,-1.3; 7 -2.825,-1.95; 8 2.825,-1.95; 9 2.825,-1.3; 10 2.825,-0.65; 11 2.825,0; 12 2.825,0.65; 13 2.825,1.3; 14 2.825,1.95
SOT65P210X110-5N = smd 1.168 x 0.356: 1 -0.965,0.66; 2 -0.965,0; 3 -0.965,-0.66; 4 0.965,-0.66; 5 0.965,0.66
3,2 = hole 3.2: 0,0
TYP184_FT = drill 1.6 pad 2.2: 1 -5.25,-0.1; 2 -1.75,-0.1; 3 1.75,-0.1; 4 5.25,-0.1
WROOM32_SKINNY = smd 1.2 x 0.9: 1 -8.5,5; 2 -8.5,3.73; 3 -8.5,2.46; 4 -8.5,1.19; 5 -8.5,-0.08; 6 -8.5,-1.35; 7 -8.5,-2.62; 8 -8.5,-3.89; 9 -8.5,-5.16; 10 -8.5,-6.43; 11 -8.5,-7.7; 12 -8.5,-8.97; 13 -8.5,-10.24; 14 -8.5,-11.51; 25 8.5,-11.51; 26 8.5,-10.24; 27 8.5,-8.97; 28 8.5,-7.7; 29 8.5,-6.43; 30 8.5,-5.16; 31 8.5,-3.89; 32 8.5,-2.62; 33 8.5,-1.35; 34 8.5,-0.08; 35 8.5,1.19; 36 8.5,2.46; 37 8.5,3.73; 38 8.5,5 | smd 0.9 x 1.2: 15 -5.7,-12.9; 16 -4.43,-12.9; 17 -3.16,-12.9; 18 -1.89,-12.9; 19 -0.62,-12.9; 20 0.65,-12.9; 21 1.92,-12.9; 22 3.19,-12.9; 23 4.46,-12.9; 24 5.73,-12.9 | smd 6 x 6: P$1 0.34,-2.7
22-23-2021 = drill 1 long: 1 -1.27,0; 2 1.27,0

### Placement (x,y rotation side)
C1  5,21.5 0 bottom
C2  5.25,31.05 90 bottom
C3  30.9,30.85 270 bottom
C4  33.1,30.85 270 bottom
C5  13.7,10.05 90 bottom
C6  20.2,10.05 90 bottom
C7  27.65,33.3 0 bottom
C8  32.4,13 180 bottom
C9  32.4,15 180 bottom
C10  29.4,14 90 bottom
C11  35.4,16 90 bottom
C12  23.4,25.1 0 bottom
C13  37.7,15.95 90 bottom
C14  36.1,8.65 0 bottom
C15  37.85,22.05 90 bottom
C16  36.4,12.95 180 bottom
C17  37.85,26.05 90 bottom
C18  35.4,30.85 270 bottom
C19  21.8,14.55 90 bottom
C20  19.2,25 0 bottom
C21  15.75,23.55 90 bottom
C22  27,10.2 0 top
C23  16.1,30.2 180 bottom
C24  19.2,32.75 270 bottom
C25  13.65,33.3 270 bottom
C26  11.6,31.6 270 bottom
C27  7.3,24.95 0 bottom
D1  7.55,9.2 90 bottom
D2  24.45,2.95 180 bottom
D3  30.1,38.6 90 top
D7  6.95,8.05 90 top
D10  31.5,3 180 bottom
FL1  11.05,10.4 90 bottom
IC1  30.7,23.2 0 bottom
IC2  9.55,20.1 180 bottom
J1  40.15,28 270 top
J2  14.45,13.8 180 top
J3  40.5,30.35 90 top
J4  1.5,13.7 270 top
PS1  16.95,10.2 0 bottom
Q1  29.9,15.5 180 top
Q2  35.1,15.5 0 top
Q3  29.2,31.6 180 top
Q4  34.3,31.6 180 top
Q5  2.5,30.8 0 bottom
Q6  2.45,23.25 180 bottom
R1  2.05,27.2 270 bottom
R2  4.15,27.2 90 bottom
R4  2.65,33.95 180 bottom
R5  27.65,31.2 0 bottom
R6  10.5,2.9 0 bottom
R7  37.7,10.7 0 bottom
R8  25.25,17 180 bottom
R9  25.4,14 90 bottom
R10  29.7,37.6 180 bottom
R11  27.4,14 90 bottom
R12  30.6,39.8 0 bottom
R13  23.95,33.05 90 bottom
R17  21.9,33.05 90 bottom
R21  15.75,19.55 90 bottom
SJ5  2.5,25.65 0 top
SJ6  2.5,23.45 0 top
SJ7  2.5,21.25 0 top
SJ8  2.5,19.05 0 top
SJ9  7.75,3.05 90 top
SW1  3.5,30.9 90 top
U1  17.1,14.8 0 bottom
U2  16.4,33.5 180 bottom
U3  21,21 0 bottom
U4  9.4,31.65 90 bottom
U$1  [3,2]  3,39 0 top
U$2  [3,2]  39,39 0 top
U$3  [3,2]  3,3 0 top
U$4  [3,2]  39,3 0 top
X1  27.35,6.95 180 top
X2  16,29.5 0 top
X6  16.85,6.35 0 top
X7  11.5,6.35 0 top

### Tracks (layer width: path | path; a pad name or v marks a point on that pad's centre or on a via)
+3V3  (via drill 0.2, 0.35)
  Top 0.254: v17.95,15.45 J2.1 | v5.66,35.5 5.76,35.5 6.36,34.9 6.36,33.7 6.83,33.23 X2.2
  Bottom 0.152: C23.1 16.14,29.2 17.95,29.2 19.67,30.92 20.05,30.92 20.18,31.05 20.18,32.55 20.05,32.68 20.05,32.75
  Bottom 0.254: C12.2 22.45,25.05 23.55,23.95 IC1.20 | C12.2 22.45,25.4 23.18,26.13 25.12,26.13 25.4,25.84 25.4,25.25 25.7,24.95 IC1.22 | C12.2 v22.45,26.55 | IC2.5 IC2.6 | IC2.6 7.55,21.5 C1.1 | C1.1 6,21.5 | C19.1 21.23,14.16 U1.3 19.23,14.16 v17.95,15.45 | IC2.7 8.2,22.1 7.55,21.45 IC2.6 | v6.07,22.84 5.95,22.72 C1.1 | C21.1 16.7,21.65 U3.12 18.18,21.35 | PS1.7 PS1.6 15.32,9.1 C5.1 | U3.11 18.18,21.35 | C20.1 19.2,24.05 19.2,21.35 | v19.3,20.9 19.3,21 19.2,21.1 19.2,21.35 | 19.2,21.35 18.18,21.35 | R13.2 v20.55,34 | v20.55,34 R17.2 | C5.1 13.7,8.85 | C5.1 13.4,9.1 12.68,9.83 v12.33,9.83 | C23.1 15.41,30.46 U2.1 | U2.7 17.86,33.25 18.33,32.77 18.83,32.77 18.85,32.75 20.05,32.75 20.23,32.93 20.23,33.68 v20.55,34 | U2.4 15.41,34.31 15.68,34.58 15.78,34.67 | 15.78,34.67 15.8,34.7 17,34.7 17.39,34.31 U2.5 | 15.78,34.67 14.96,34.67 v14.85,34.78 | R4.2 4.1,33.95 v5.65,35.5 v5.66,35.5
  pour Route15: 0.1,41.9 0.1,0.1 41.9,0.1 41.9,41.9 25,41.9 25,35.9 7,35.9 7,41.9
+5V  (via drill 0.2)
  Route15 0.254: v30.27,16.21 28.54,16.21 28.24,15.92 27.76,15.92 27.24,16.43 27.24,28.61 v25.6,30.25
  Bottom 0.254: IC1.5 31.45,16.7 30.9,16.15 30.3,16.15 | 30.3,16.15 29.8,16.15 29.4,15.75 C10.2 | 30.3,16.15 30.3,16.18 v30.27,16.21 | R5.2 26.55,31.2 v25.6,30.25
+5V_LED  (via drill 0.2)
  Top 0.152: D3.4 30.23,39.35 v33.65,39.35
  Top 0.254: v18.2,34.68 16.66,34.68 16.03,34.68 15.34,34 14.7,34 14.4,33.7 v11.6,33.7 | D3.4 28.45,40.35 v28.3,40.2
  Route15 0.152: 18.2,34.6 v18.2,34.68
  Bottom 0.152: v28.3,40.2 28.05,39.95 26.6,39.95 26.1,39.45 26.1,35.7 25.65,35.25 20.2,35.25 19.2,34.25 C24.1 | v33.65,39.35 34.55,38.45 34.6,38.45 35.15,37.9 35.15,36.6 35.89,35.86 36.05,35.86 37.05,34.86 37.55,34.86 38.24,34.16 J3.4
  Bottom 0.254: U2.6 19.15,33.75 C24.1 18.22,34.68 v18.2,34.68 | U4.5 11.4,32.62 | 11.4,32.62 11.54,32.62 C26.1 | v11.6,33.7 11.7,33.6 11.7,32.91 11.4,32.62
+12V
  Bottom 0.254: IC1.3 32.45,17.8 33.65,16.6 35.05,16.6 C11.2
+24V  (via drill 0.2, 0.35)
  Top 0.254: Q3.8 31.2,26.92 v31.94,26.18 | v31.55,11.51 31.65,11.61 31.65,12.9
  Top 0.508: Q3.7 Q3.8 | Q3.7 30.43,29.5 31.15,29.5 31.2,29.45 Q3.8 | Q3.7 29.93,28.8 30.14,28.6 30.91,28.6 31.2,28.9 Q3.8 | Q1.7 30.89,13.25 31.45,13.25 Q1.8 | Q1.7 30.54,12.87 30.7,12.7 | 30.7,12.7 30.9,12.5 31.3,12.5 | 31.3,12.5 31.5,12.5 31.8,12.8 Q1.8 | Q1.7 30.7,12.73 30.7,12.7 | Q1.7 30.9,12.9 31.05,12.75 | 31.05,12.75 31.3,12.5 | Q1.8 31.65,12.9 | 31.2,12.9 31.05,12.75
  Top 1.27: 26.3,12.9 Q1.5 Q1.6 Q1.7 | 26.3,12.9 24.5,11.1 24.5,10.16 C22.+ 22.1,7.84 X1.4 22.1,5.8 23.45,4.45 27.65,4.45 29.1,5.9 X1.2 | 26.3,12.9 26.9,13.5 26.9,28.5 Q3.5 Q3.6 Q3.7 30.04,29.1 30.5,29.1
  Bottom 0.254: IC1.4 31.95,17.65 33.35,16.25 C9.2 C8.2 | C8.2 33.4,12.95 C16.1 36.5,11.9 37.3,11.9 37.55,11.65 37.55,8.4 37.16,8.65 C14.1 | v31.94,26.18 v31.95,26.19 IC1.33 31.95,28.35 33.1,29.5 C4.2 | C8.2 31.86,11.51 v31.55,11.51
  Bottom 0.406: 26.05,3.55 D2.A
  Bottom 0.61: D10.C 29.42,2.95 D2.A 22.55,7.05 X1.4
BMA1
  Top 0.152: 32.95,29.2 32.95,30.3
  Top 0.254: Q4.5 33.05,29 | Q4.5 32.43,29.04 33.66,29.04 | Q4.5 32.4,29.45 32.95,30 | Q4.6 33.46,29.2
  Top 0.406: Q4.5 32.6,29.2 32.95,29.2 33.46,29.2 | Q4.6 33.25,29.41
  Top 0.508: 33.05,29 Q4.6 | 33.66,29.04 Q4.6 | Q4.5 32.65,28.75 32.65,28.5 33.2,28.5 33.5,28.5 33.66,28.66 Q4.6
  Top 1.1: Q3.3 28.66,32.19 29.9,30.95 32.3,30.95 32.95,30.3 | 32.95,30 32.95,29.2
  Top 1.27: 33.2,28.5 33.35,28.35 33.35,27.35 35.09,25.46 J1.2
  Bottom 0.254: J1.2 39.14,25.61 37.85,26.9 C17.2 36.8,25.95 36.8,24.75 36.5,24.45 IC1.40
BMA2  (via drill 0.2)
  Top 0.254: v35.3,27.05 35.3,28.3 34.9,28.7 | v34.28,32.62 34.28,32.37
  Top 0.508: Q4.7 34.98,29.05 35.55,29.05 35.6,29 Q4.8 35.85,28.65 34.9,28.65 34.9,28.7 34.9,28.96 Q4.7
  Top 1.1: Q3.1 31.2,32.9 31.73,32.37 33.13,32.37 | 35.55,28 35.55,29.05 35.55,29.95 33.13,32.37 | 33.13,32.37 34.28,32.37
  Top 1.27: 35.55,28 J1.1
  Bottom 0.254: IC1.37 35.3,26.38 v35.3,27.05 | C18.1 35.1,31.8 v34.28,32.62
BMB1  (via drill 0.2)
  Top 0.152: v37.7,17.95 37.16,17.95 Q2.5
  Top 0.254: v33.68,20.69 33.7,20.68 33.7,19.95
  Top 0.508: Q2.6 36.03,17.8 36.4,17.8 36.7,17.8 Q2.5
  Top 1.016: 29.27,19.61 29.6,19.95
  Top 1.18: 29.6,19.95 33.7,19.95 35.55,19.95 35.6,19.9
  Top 1.27: 35.6,19.9 36.25,19.9 | 36.25,19.9 36.75,19.9 39.92,23.07 J1.3 | 36.25,19.9 36.4,19.75 36.4,17.8 | Q1.3 29.27,19.61 29.56,19.91 29.6,19.91
  Bottom 0.152: v37.7,17.95 C13.2
  Bottom 0.254: IC1.48 33.92,20.45 v33.68,20.69
BMB2  (via drill 0.2)
  Top 0.254: v36.24,21.86 36.76,21.86 v38.9,24 | Q2.7 34.44,18.1
  Top 1.27: Q1.1 Q2.8 34.44,18.1 34.44,16.88 35.11,16.21 37.54,16.21 37.55,16.2 37.56,16.21 37.63,16.21 40.15,18.73 J1.4
  Bottom 0.254: C15.1 38.42,20.53 | v36.24,21.86 36.15,21.95 IC1.45 | v38.9,24 38.88,23.98 38.88,21.93 38.05,21.1 C15.1 | C15.1 38.57,20.38 J1.4
CA1
  Bottom 0.254: IC1.42 36.25,23.45 37.85,25.05 C17.1
CA2
  Bottom 0.254: IC1.35 32.95,28.2 33.31,28.56 34.13,28.56 34.54,28.97 34.54,29.79 34.65,29.9 C18.2
CANH
  Bottom 0.254: FL1.1 10.55,6.67 X7.1 10.23,4.72 11.45,3.5 | 11.45,3.5 R6.1 | 11.45,3.5 12.05,2.9 13.75,2.9 15.58,4.73 X6.1
CANL
  Top 0.254: SJ9.1 10.24,2.29 12.68,4.72 | X7.2 12.77,4.82 12.68,4.72 | 12.68,4.72 12.78,4.83 13.65,3.95 17.35,3.95 18.12,4.72 X6.2
  Bottom 0.254: FL1.4 12.77,7.66 X7.2
CB1
  Bottom 0.254: C13.1 36.8,15 36.43,15.37 36.43,17.72 36.27,17.88 34.53,17.88 34.37,17.72 34.37,17.65 33.17,17.65 32.95,17.88 IC1.2
CB2
  Bottom 0.254: IC1.43 37.8,22.95 C15.2
DTR
  Bottom 0.254: R2.1 4.15,25 Q6.2 2.85,24.25 1.6,23 1.6,20.12 5.54,16.18 5.54,15.83 6.14,15.23 6.14,13.83 7.07,12.9 7.62,12.9 8.05,13.34 8.05,17.05 8.15,17.15 8.65,17.15 8.8,17.3 IC2.23
GND  (via drill 0.2, 0.35)
  Top 0.254: v8.85,34.4 7.6,34.4 X2.1 | X2.38 25.05,34.5 25.15,34.4 25.35,34.4 v25.6,34.15 | X2.15 9.3,16.6 v9.25,16.65 | J2.8 10.2,13.8 v10.05,13.95 | 1.74,19.2 SJ7.1 SJ6.1 SJ5.1 1.74,27.61 SW1.3 SW1.4 | 1.74,19.2 SJ8.1 1.75,19.04 | 4.5,17.19 4.3,16.99 4.44,16.99 4.5,17.05 4.5,17.19 | 4.5,17.19 4.5,17.25 4.3,17.05 4.1,17.05 J4.S1 | D7.1 7.18,6.5 5.2,6.5 2.95,8.75 2.95,10.4 | v31.05,35.8 30.98,35.88 D3.2 | J4.S6 2.7,10.4 | J4.S5 J4.S4 J4.S3 2.7,11.3 2.7,10.4 | J4.S5 1.5,18.96 1.74,19.2 | v5.2,11.65 4.92,11.65 J4.5 4.17,10.72 J4.S2 3.85,10.4 2.95,10.4 | 2.7,10.4 2.95,10.4 | J4.S5 3.85,17 J4.S1 | v4.5,18.6 4.13,18.23 4.13,18.13 3.95,17.96 J4.S1
  Top 1.27: X1.3 25.6,7.45 28.35,10.2 C22.- 30.34,10.2 32.6,7.94 X1.1
  Bottom 0.152: U2.9 U2.9_1 | 9.4,31.65 9.4,32.22 v9.43,32.25
  Bottom 0.254: IC1.6 30.95,20.85 v30.7,21.1 v30.7,22.15 IC1.49 | v31.75,22.15 v32.8,21.1 | v31.75,22.15 v32.8,22.15 | v31.75,23.2 v32.8,23.2 | v31.75,23.2 v32.8,24.25 | v31.75,24.25 v32.8,25.3 | v31.75,24.25 v31.75,25.3 | IC1.49 v31.75,24.25 | IC1.49 v31.75,23.2 | v31.75,22.15 v31.75,21.1 | IC1.49 v31.75,22.15 | IC1.49 30.7,25.05 | 30.7,25.05 v30.7,25.3 | IC1.49 v30.7,24.25 v29.65,25.3 | IC1.49 v29.65,24.25 v28.6,24.25 28.4,24.45 IC1.21 25.35,24.45 24.7,25.1 C12.1 | IC1.49 v28.6,25.3 | IC1.49 v28.6,23.2 28.35,23.45 IC1.19 | IC1.49 v29.65,23.2 v28.6,22.15 | IC1.49 v29.65,22.15 v29.65,21.1 | IC1.49 v28.6,21.1 | IC1.49 28.45,20.95 IC1.11 IC1.12 27.23,18.31 25.56,18.31 24.3,17.05 R8.1 24.3,14.45 | IC1.30 30.45,25.3 30.7,25.05 | C9.1 C8.1 29.7,13 | C10.1 29.45,13 29.7,13 | R11.1 27.65,13.05 | 27.65,13.05 29.65,13.05 29.7,13 | C11.1 37.35,13.1 C16.2 | 24.3,14.45 24.3,14.1 24.42,13.98 26.72,13.98 27.65,13.05 | 24.3,14.45 24.2,14.35 v23.7,14.35 22.55,15.5 C19.2 19.82,15.5 U1.2 | v8.85,34.4 7.3,34.4 5.25,32.35 C2.2 | C7.2 26.45,33.3 v25.6,34.15 | IC2.2 8.8,19.35 IC2.THERM 10.25,19.4 v10.25,19.35 | C6.2 18.68,11 PS1.2 PS1.1 17.12,11.4 PS1.11_1 | 16.95,9.35 PS1.11 PS1.11_1 | PS1.11_1 16.95,11.61 | v4.5,18.6 4.5,19.4 4.05,19.85 C1.2 4.05,22.65 C27.2 | C21.2 16.25,25 C20.2 | C21.2 15.97,24.5 17.05,23.43 17.05,23.01 17.76,22.3 U3.13 | C21.2 14.48,24.5 v14.47,24.52 | PS1.11_1 16.95,11.21 | v39.7,9.3 39.7,8.6 | C14.2 35.25,8.75 | C5.2 14.7,12 16.18,12 PS1.11_1 | C23.2 17.39,30.54 17.39,31.7 | 17.39,31.7 17.39,32.6 | 17.39,32.6 U2.8 | U2.9 16.73,33.17 16.73,33.02 17.14,32.6 17.39,32.6 | C24.2 19.1,31.7 17.39,31.7 | U4.3 8.74,31.24 9.15,31.65 9.4,31.65 10.5,31.65 11.5,30.65 C26.2
  Bottom 0.508: R10.1 27.65,38.23 v27.65,39.05 | R10.1 28.28,38.05 v26.9,38.05 | 28.38,37.85 28.38,39.05 v28.4,39.05 v27.65,39.05 | v26.9,37.15 27.4,37.15 27.4,36.9 27.65,36.9 | 27.65,36.9 27.95,36.9 28.1,37.05 28.1,37.42 R10.1 | v27.65,36.15 27.65,36.9 | R10.1 28.4,37.48 v28.4,36.1 27.7,36.1 v27.65,36.15 | R7.1 38.9,10.48 v38.9,9.3 v39.7,9.3 | v39.7,9.3 39.7,10.07 | 39.7,10.07 39.34,10.44 39.36,10.46 | 39.36,10.46 R7.1 | v40.55,10.1 v40.55,9.35 40.5,9.3 v39.7,9.3 | v40.55,10.1 40.52,10.07 39.7,10.07 | v40.55,11.3 40.5,11.25 39.3,11.25 39.07,11.02 39.07,11 | R7.1 39.12,10.95 39.07,11 | v38.9,12.2 38.9,11.17 39.07,11 | v39.7,12.2 39.6,12.1 39.6,10.7 39.36,10.46 | v40.55,11.3 v40.55,12.2 v39.7,12.2 | C16.2 37.45,12.95 38.2,12.2 v38.9,12.2 | v26.9,38.05 v26.9,39.05 v27.65,39.05 | v26.9,37.15 v26.9,36.15 v27.65,36.15 | v26.9,38.05 v26.9,37.15 | v40.55,11.3 v40.55,10.1 | v38.9,12.2 v39.7,12.2
  Bottom 0.61: D10.A 32.6,3 30.5,5.1 27.55,5.1 X1.3 | v39.7,9.3 39.7,8.2 38.87,7.37 37.19,7.37 36.87,7.05 35.95,7.05 35.15,7.85 C14.2 33.55,7.05 X1.1
  other vias: 30.7,23.2 16.34,26.8
  pour Route2: 0.1,41.9 0.1,0.1 41.9,0.1 41.9,41.9 25,41.9 25,35.9 7,35.9 7,41.9
GPIO0  (via drill 0.2)
  Top 0.254: X2.25 23.81,17.3 v23.05,17.3
  Bottom 0.254: Q6.3 2.88,22.15 5.25,24.52 5.25,25.95 5.61,26.31 10.7,26.31 10.93,26.07 12.83,26.07 13.07,25.83 17.28,25.83 17.48,26.03 20.92,26.03 21.3,25.64 21.3,24.36 20.59,23.65 20.3,23.65 20,23.35 20,17.62 20.23,17.39 22.96,17.39 v23.05,17.3
HA1  (via drill 0.2)
  Top 0.254: v26.6,35.35 26.6,34.99 Q3.4
  Bottom 0.254: IC1.41 34.14,23.94 33.87,24.21 33.87,27.12 34.5,27.75 35.62,27.75 36.82,28.95 36.85,28.95 36.85,33.1 35.05,34.9 27.05,34.9 v26.6,35.35
HA2  (via drill 0.2)
  Top 0.254: v29.75,32.7 29.7,32.75 29.7,33.97 Q3.2
  Bottom 0.254: IC1.36 34.23,28.16 35.45,28.16 36.43,29.13 36.43,32.92 35.65,33.7 30.05,33.7 29.75,33.4 v29.75,32.7
HB1  (via drill 0.2)
  Top 0.254: v39.51,15.24 39,14.74 30.81,14.74 28,17.55 Q1.4
  Bottom 0.254: IC1.1 33.45,18.82 33.99,18.29 37.16,18.29 37.41,18.53 37.89,18.53 38.73,17.7 38.73,16.02 v39.51,15.24
HB2  (via drill 0.35)
  Top 0.254: Q1.2 30.54,17.11 32.36,15.29 38.4,15.29 40.51,17.39 v40.56,17.34
  Bottom 0.254: IC1.44 36.62,22.45 36.82,22.25 36.82,20.28 37.3,19.8 38.35,19.8 40.56,17.59 v40.56,17.34
IO4_CANRX  (via drill 0.35)
  Top 0.254: X2.26 22.66,19.26 22.46,19.06 22.46,13.79 v23.3,12.95
  Bottom 0.254: U1.4 20.71,12.89 20.93,12.67 23.02,12.67 v23.3,12.95
IO5_CANTX  (via drill 0.35)
  Top 0.254: X2.29 25.43,23.07 25.7,22.8 25.7,17.65 24.8,16.75 24.6,16.75 v23.55,15.7
  Bottom 0.254: v23.55,15.7 22.5,16.75 19.8,16.75 U1.1
IO15_CSN_TMC  (via drill 0.2)
  Top 0.254: v20.6,18 20.5,17.9 20.5,16.64 X2.23
  Bottom 0.254: IC1.13 25.51,19.43 25.51,19.03 24.57,18.1 20.7,18.1 v20.6,18
IO16_DRV_ENN  (via drill 0.35)
  Top 0.254: v21.15,29.65 21.25,29.55 21.25,23.65 22.55,22.35 22.55,21.5 23.52,20.53 X2.27
  Bottom 0.254: IC1.28 29.45,28.42 28.6,29.27 21.53,29.27 v21.15,29.65
IO17_CSN_AS  (via drill 0.2)
  Top 0.254: X2.28 23.55,21.8 23.01,22.34 v23.01,23.52
  Bottom 0.254: v23.01,23.52 23.57,22.95 U3.1
IO18_CSN_EXT  (via drill 0.2, 0.35)
  Top 0.254: J2.2 v16.95,15.45 | X2.30 22.88,24.34 v22.25,23.71 | v20.6,18.95 20.2,18.55 19.37,18.55 18.87,18.05 v18.87,17.82
  Bottom 0.254: v22.25,23.71 22.05,23.51 21.08,23.51 20.44,22.87 20.44,20.93 20.6,20.77 v20.6,18.95 | v18.87,17.82 16.95,15.89 v16.95,15.45
IO19_ALG_OUT  (via drill 0.2)
  Top 0.152: X2.31 25.21,25.61 26.04,26.44 26.04,29.16 26.5,29.63 26.5,34.35 v26.05,34.8
  Route15 0.152: v26.05,34.8 28.1,34.8 29.63,36.33 31.27,36.33 31.58,36.02 31.58,34.92 33.2,33.3 33.2,32.2 33.78,31.62 J3.2
IO25_ADR1
  Top 0.152: SJ6.2 5.75,23.45 5.9,23.6 6.4,23.6 7,23 7.43,23 X2.10
IO26_ADR2
  Top 0.152: SJ7.2 6.95,21.25 X2.11
IO27_ADR3
  Top 0.254: SJ8.2 3.96,19.05 5.41,20.5 7.47,20.5 X2.12
IO32_NEOPIXEL_3V3  (via drill 0.2)
  Top 0.254: X2.8 8.41,25.61 8.95,26.15 v8.95,27.7
  Bottom 0.254: v8.95,27.7 8.95,28.75 9.07,28.88 9.4,29.2 U4.2 U4.1
IO33_ADR0
  Top 0.152: SJ5.2 4.56,24.4 7.44,24.4 X2.9
  Top 0.254: 3.76,26.1 SJ5.2
LA1  (via drill 0.35)
  Top 0.254: v32.35,36.05 32.35,34.24 Q4.4
  Bottom 0.254: IC1.39 36.2,24.95 36.39,25.14 36.39,27.34 37.9,28.84 37.9,34 37.4,34.5 36.9,34.5 35.9,35.5 | 35.9,35.5 32.9,35.5 v32.35,36.05 | 35.9,35.5
LA2  (via drill 0.35)
  Top 0.254: v37.2,33.75 37.2,33.4 36.62,32.82 35.79,32.82 34.94,33.67 Q4.2
  Bottom 0.254: IC1.38 34.97,25.55 35.72,25.55 35.99,25.82 35.99,27.51 37.3,28.82 37.3,33.65 v37.2,33.75
LB1  (via drill 0.2)
  Top 0.254: v39.1,13.15 38.85,12.9 Q2.4
  Bottom 0.254: v39.1,13.15 39.1,13.9 40.17,14.97 40.17,15.51 39.14,16.55 39.14,17.86 38.06,18.94 36.66,18.94 35.95,19.65 35.95,20.62 35.61,20.96 IC1.47
LB2  (via drill 0.2)
  Top 0.254: v39.9,13.75 39.43,13.75 38.85,14.33 34.7,14.33 34.47,14.09 Q2.2
  Bottom 0.254: IC1.46 34.96,21.36 35.78,21.36 36.36,20.79 36.36,19.97 36.98,19.34 38.23,19.34 39.9,17.67 39.9,16.43 40.57,15.75 40.57,14.8 39.9,14.13 v39.9,13.75
MISO  (via drill 0.35)
  Top 0.254: v21.85,22 21.55,22 17.7,18.15 10.86,18.15 10.7,17.99 8.65,17.99 | X2.14 8.65,17.99 | J2.5 13.95,14.8 13.46,15.29 11.78,15.29 11.36,15.72 9.13,15.72 8.44,16.41 8.44,17.78 8.65,17.99
  Bottom 0.254: IC1.16 25,21.95 24.7,21.65 U3.3 22.2,21.65 v21.85,22
MOSI  (via drill 0.35)
  Top 0.254: J2.4 14.95,15.25 14.5,15.7 11.95,15.7 11.57,16.08 X2.16 11.57,17.37 11.94,17.74 17.87,17.74 20.11,19.99 20.46,19.99 arc-90 21.2,19.25 21.2,18.05 arc90 21.6,17.65 arc90 22.02,18.07 22.02,19.27 arc-90 22.45,19.7 22.65,19.7 arc90 22.98,20.02 arc90 22.65,20.35 21.8,20.35 arc-90 21.45,20.7 arc-90 21.8,21.05 v21.85,21.05
  Bottom 0.254: IC1.15 25.45,21.45 25,21 U3.4 21.9,21 v21.85,21.05
N$1
  Bottom 0.254: C25.1 14.15,33.75 U2.3
N$2
  Bottom 0.254: D1.C 7.55,2.45 8.7,1.3 20.6,1.3 21.55,2.25 21.6,2.25 21.6,2.95 | PS1.3 PS1.4 19.3,9.6 20.2,8.7 C6.1 20.2,6 21.6,4.6 21.6,2.95 | D2.C 21.6,2.95
N$3
  Bottom 0.254: IC1.31 30.95,29.85 C3.2
N$4
  Bottom 0.254: IC1.32 31.45,28.66 31.93,29.13 31.93,30.77 C3.1
N$5
  Bottom 0.254: C4.1 33.1,31.7 34.13,30.67 34.13,29.13 33.97,28.97 33.15,28.97 32.45,28.27 IC1.34
N$6
  Bottom 0.254: C25.2 14.55,33.25 U2.2
N$7
  Bottom 0.254: IC1.29 29.95,28.9 28.6,30.25 R5.1 C7.1
N$8
  Bottom 0.254: FL1.2 10.55,13.25 12.73,15.44 U1.7
N$9  (via drill 0.35)
  Top 1.016: Q4.1 36.2,35.27 35.47,36 33.66,36
  Top 1.27: Q4.3 33.66,36 33.66,37.09 v32.9,37.85 | v32.9,37.85 32.6,37.55 v32.6,37.2 | v32.9,37.85 33.85,37.85 v33.95,37.75 33.95,37.55 34.3,37.2 v34.5,37.2
  Bottom 0.254: R12.1 31.55,38.03 R10.2
  Bottom 0.406: v32.6,37.2 32.6,37.55 v32.9,37.85 33.35,37.4 v33.35,37.2 33.4,37.2 v33.95,37.75 v34.5,37.2 34.4,37.3 31.42,37.3 R10.2
  Bottom 1.27: 34.25,37.55 31.17,37.55 R10.2
N$10  (via drill 0.35)
  Top 0.508: v32.65,11.3 33.05,11.3 33.2,11.15
  Top 1.27: Q2.1 33.2,11.15 33.5,10.85 35.35,10.85 35.73,11.23 Q2.3
  Bottom 0.254: 25.61,13.05 R9.1 25.4,11.95 25.5,11.85 30.2,11.85 31.4,10.65 32,10.65 v32.65,11.3
  Bottom 0.508: v33.9,11.1 34.3,10.7 | 34.3,10.7 v34.45,10.55 34.45,10.7 v34.9,11.15 35.05,11.3 35.65,10.7 R7.2 | 34.3,10.7 33.3,10.7 32.7,11.3 v32.65,11.3
  Bottom 1.27: R7.2 33.3,10.7 v33.25,10.7
N$11
  Bottom 0.254: U1.6 12.77,14.16 11.55,12.95 FL1.3
N$12
  Bottom 0.254: R2.2 3.45,28.85 Q5.1
N$13
  Bottom 0.254: R1.2 2.05,24.8 Q6.1
N$15  (via drill 0.2)
  Top 0.152: v9.3,33.65 10.9,35.25 25.65,35.25 26.1,35.7 26.1,40.15 v26.5,40.55 | v33,40.5 32.85,40.35 D3.3
  Bottom 0.152: U4.4 8.74,32.7 8.74,33.09 v9.3,33.65 | v26.5,40.55 26.8,40.85 32.85,40.85 33,40.7 v33,40.5
  Bottom 0.254: 7.7,32.7 8.74,32.7
N$16  (via drill 0.35)
  Top 0.254: v8.45,5.15 8.45,4.51 SJ9.2
  Bottom 0.254: R6.2 9.55,3.35 8.45,4.45 v8.45,5.15
N$21  (via drill 0.35)
  Top 0.254: v15.95,15.45 J2.3
  Bottom 0.254: R21.1 15.95,18.4 v15.95,15.45
N$22
  Bottom 0.254: IC2.16 12.15,19.85 12.45,20.15 12.45,21.82 11.49,22.78 10.89,22.78 8.72,24.95 C27.1
NEO_OUT
  Top 0.152: D3.1 31.12,38.75 34.3,38.75 35.4,37.65 35.4,36.95 35.6,36.75 35.8,36.75 37.9,34.65 37.9,33.95 38.96,32.89 J3.3
RESET  (via drill 0.35)
  Top 0.254: SW1.2 5.4,32.7 6.14,31.96 | X2.3 6.14,31.96 | SW1.1 5.4,29.6 v3.7,31.3 5.48,31.3 6.14,31.96
  Bottom 0.152: 4.9,30.1 C2.1
  Bottom 0.254: R4.1 2.5,33.15 Q5.3 3.1,31.3 v3.7,31.3 4.25,30.75 4.9,30.1
RTS  (via drill 0.35)
  Top 0.254: v10.3,27 9.5,26.2 9.5,25.1 v9.9,24.7
  Bottom 0.254: Q5.2 1.55,28.65 R1.1 3.02,27.18 5.67,27.18 6.09,26.75 10.05,26.75 v10.3,27 | IC2.19 11.99,18.1 12.97,19.07 12.97,21.88 11.66,23.19 11.11,23.19 9.75,24.55 v9.9,24.7
RXD0  (via drill 0.35)
  Top 0.254: X2.34 23,29.42 21.42,31.01 12.98,31.01 11.94,29.97 11.94,24.39 11.8,24.25 v11.55,24.25
  Bottom 0.254: v11.55,24.25 11.74,24.25 13.78,22.21 13.78,18.73 11.99,16.95 10.4,16.95 9.8,17.55 IC2.21
SCK  (via drill 0.35)
  Top 0.254: X2.13 8.26,19.26 10.9,21.9 17.05,21.9 | v21.15,22.6 20.45,21.9 17.05,21.9 | v17.05,20.75 17.05,21.9
  Bottom 0.254: U3.2 22.88,22.3 22.08,23.1 21.65,23.1 v21.15,22.6 21.15,20.65 23.25,18.55 24.45,18.55 25.1,19.2 25.1,20.45 25.6,20.95 IC1.14 | R21.2 16.8,20.5 v17.05,20.75
SCL  (via drill 0.2, 0.35)
  Top 0.152: J2.7 11.95,13.2 11.45,12.7 v9.65,12.7
  Top 0.254: v10.2,25.65 11.13,26.58 11.13,30.3 12.69,31.86 20.5,31.86 | X2.36 24.4,31.86 20.5,31.86 | v20.75,32.3 20.75,32.11 20.5,31.86
  Bottom 0.254: v10.2,25.65 11.25,25.65 12.21,24.69 12.21,24.37 14.24,22.34 14.24,18.62 10.62,15 9.9,15 9.25,14.35 9.25,13.1 v9.65,12.7 | 21.9,32.38 R17.1 20.95,32.1 v20.75,32.3
SDA  (via drill 0.2, 0.35)
  Top 0.152: J2.6 12.95,14.6 12.68,14.87 11.49,14.87 v11.39,14.97
  Top 0.254: X2.33 23.7,28.15 21.25,30.6 20,30.6 | 20,30.6 13.15,30.6 12.55,30 12.55,25.7 12.6,25.7 v12.6,25.35 | v20.2,30 20,30.2 20,30.6
  Bottom 0.254: v11.39,14.97 11.39,15.09 14.65,18.35 14.65,22.55 12.62,24.58 12.62,25.33 v12.6,25.35 | 23.95,31.95 R13.1 23.95,31.35 23.35,30.75 20.95,30.75 v20.2,30
SRAH  (via drill 0.2)
  Route15 0.254: v28,16.5 27.65,16.85 27.65,33.75 29.7,35.8 v30,35.8
  Bottom 0.254: v28,16.5 28.59,17.09 28.91,17.09 29.95,18.13 IC1.8 | R12.2 29.8,39.65 29.8,36 v30,35.8
SRAL
  Bottom 0.254: R11.2 30.45,18 IC1.7
SRBH
  Bottom 0.254: R9.2 26.42,15.97 26.97,15.97 27.13,16.13 27.13,17.07 27.55,17.49 28.74,17.49 29.36,18.11 29.36,18.16 29.45,18.25 | IC1.9 29.45,18.25 | 29.45,18.25 29.45,18.2
SRBL
  Bottom 0.254: R8.2 27.1,17.9 28.57,17.9 28.85,18.18 28.85,18.2 28.95,18.3 IC1.10
TMC_DIAG0  (via drill 0.35)
  Top 0.152: v9.8,28.49 8.92,29.37 7.55,29.37 X2.5
  Bottom 0.152: IC1.26 28.45,28.35 28.3,28.5 v9.81,28.5 v9.8,28.49
TMC_DIAG1  (via drill 0.35)
  Top 0.152: v10.25,29.3 9.7,29.3 8.31,30.69 X2.4
  Bottom 0.152: IC1.27 28.95,27.42 28.95,28.28 28.33,28.9 10.65,28.9 v10.25,29.3
TXD0  (via drill 0.35)
  Top 0.254: v10.85,24.9 11.54,25.59 11.54,30.14 12.81,31.41 21.59,31.41 22.61,30.39 24.2,30.39 X2.35
  Bottom 0.254: v10.85,24.9 v10.84,24.89 10.84,24.03 11.28,23.59 11.83,23.59 13.37,22.05 13.37,18.9 11.89,17.42 10.59,17.42 10.3,17.71 IC2.20
USBD+  (via drill 0.35)
  Top 0.254: 6.2,13.55 v7.33,13.55 v7.34,13.56 | 6.2,13.55 6.2,9.29 D7.3 | J4.3 6.05,13.7 6.2,13.55
  Bottom 0.254: v7.34,13.56 7.46,13.67 7.46,16.35 6.35,17.45 6.35,19.4 6.8,19.85 IC2.3 7.46,19.85
USBD-  (via drill 0.35)
  Top 0.254: D7.4 7,8.16 7,9.65 8.1,10.75 8.1,13.85 7.65,14.3 v6.8,14.3 6.75,14.35 J4.2
  Bottom 0.254: v6.8,14.3 7.05,14.55 7.05,16.18 5.9,17.33 5.9,19.64 6.61,20.35 IC2.4
VBUS  (via drill 0.2, 0.35)
  Top 0.254: D7.2 8.2,9.23 v8.2,9.8 | v6.2,16.1 6.2,15.6 5.6,15 5.1,15 J4.1 3.45,15 v3.05,15.4
  Bottom 0.254: IC2.8 8.8,23.7 5.8,23.7 5,22.9 5,20.6 5.3,20.3 5.3,17 v6.2,16.1 | v8.2,9.8 7.7,10.3 7.7,11.25 D1.A 6.8,11.4 4.8,13.4 4.75,13.45 3.05,15.15 v3.05,15.4
(copper drawn outside any net)
  shapes: Top area x1

### Text on the board
tPlace: MuST | CANH/CANL | CANH/CANL | 120R
tNames: RESET | B2 B1 A1 A2 | ADRESS SELECT | GND SCL SDA MISO MOSI SCK CSN 3V3 | Stepper Steuerung v3 / Sven Suppelt 07.2020 | +24V GND +24V GND